# Altium schematic sheet DAU-3Phase-PSU.SchDoc
size A3
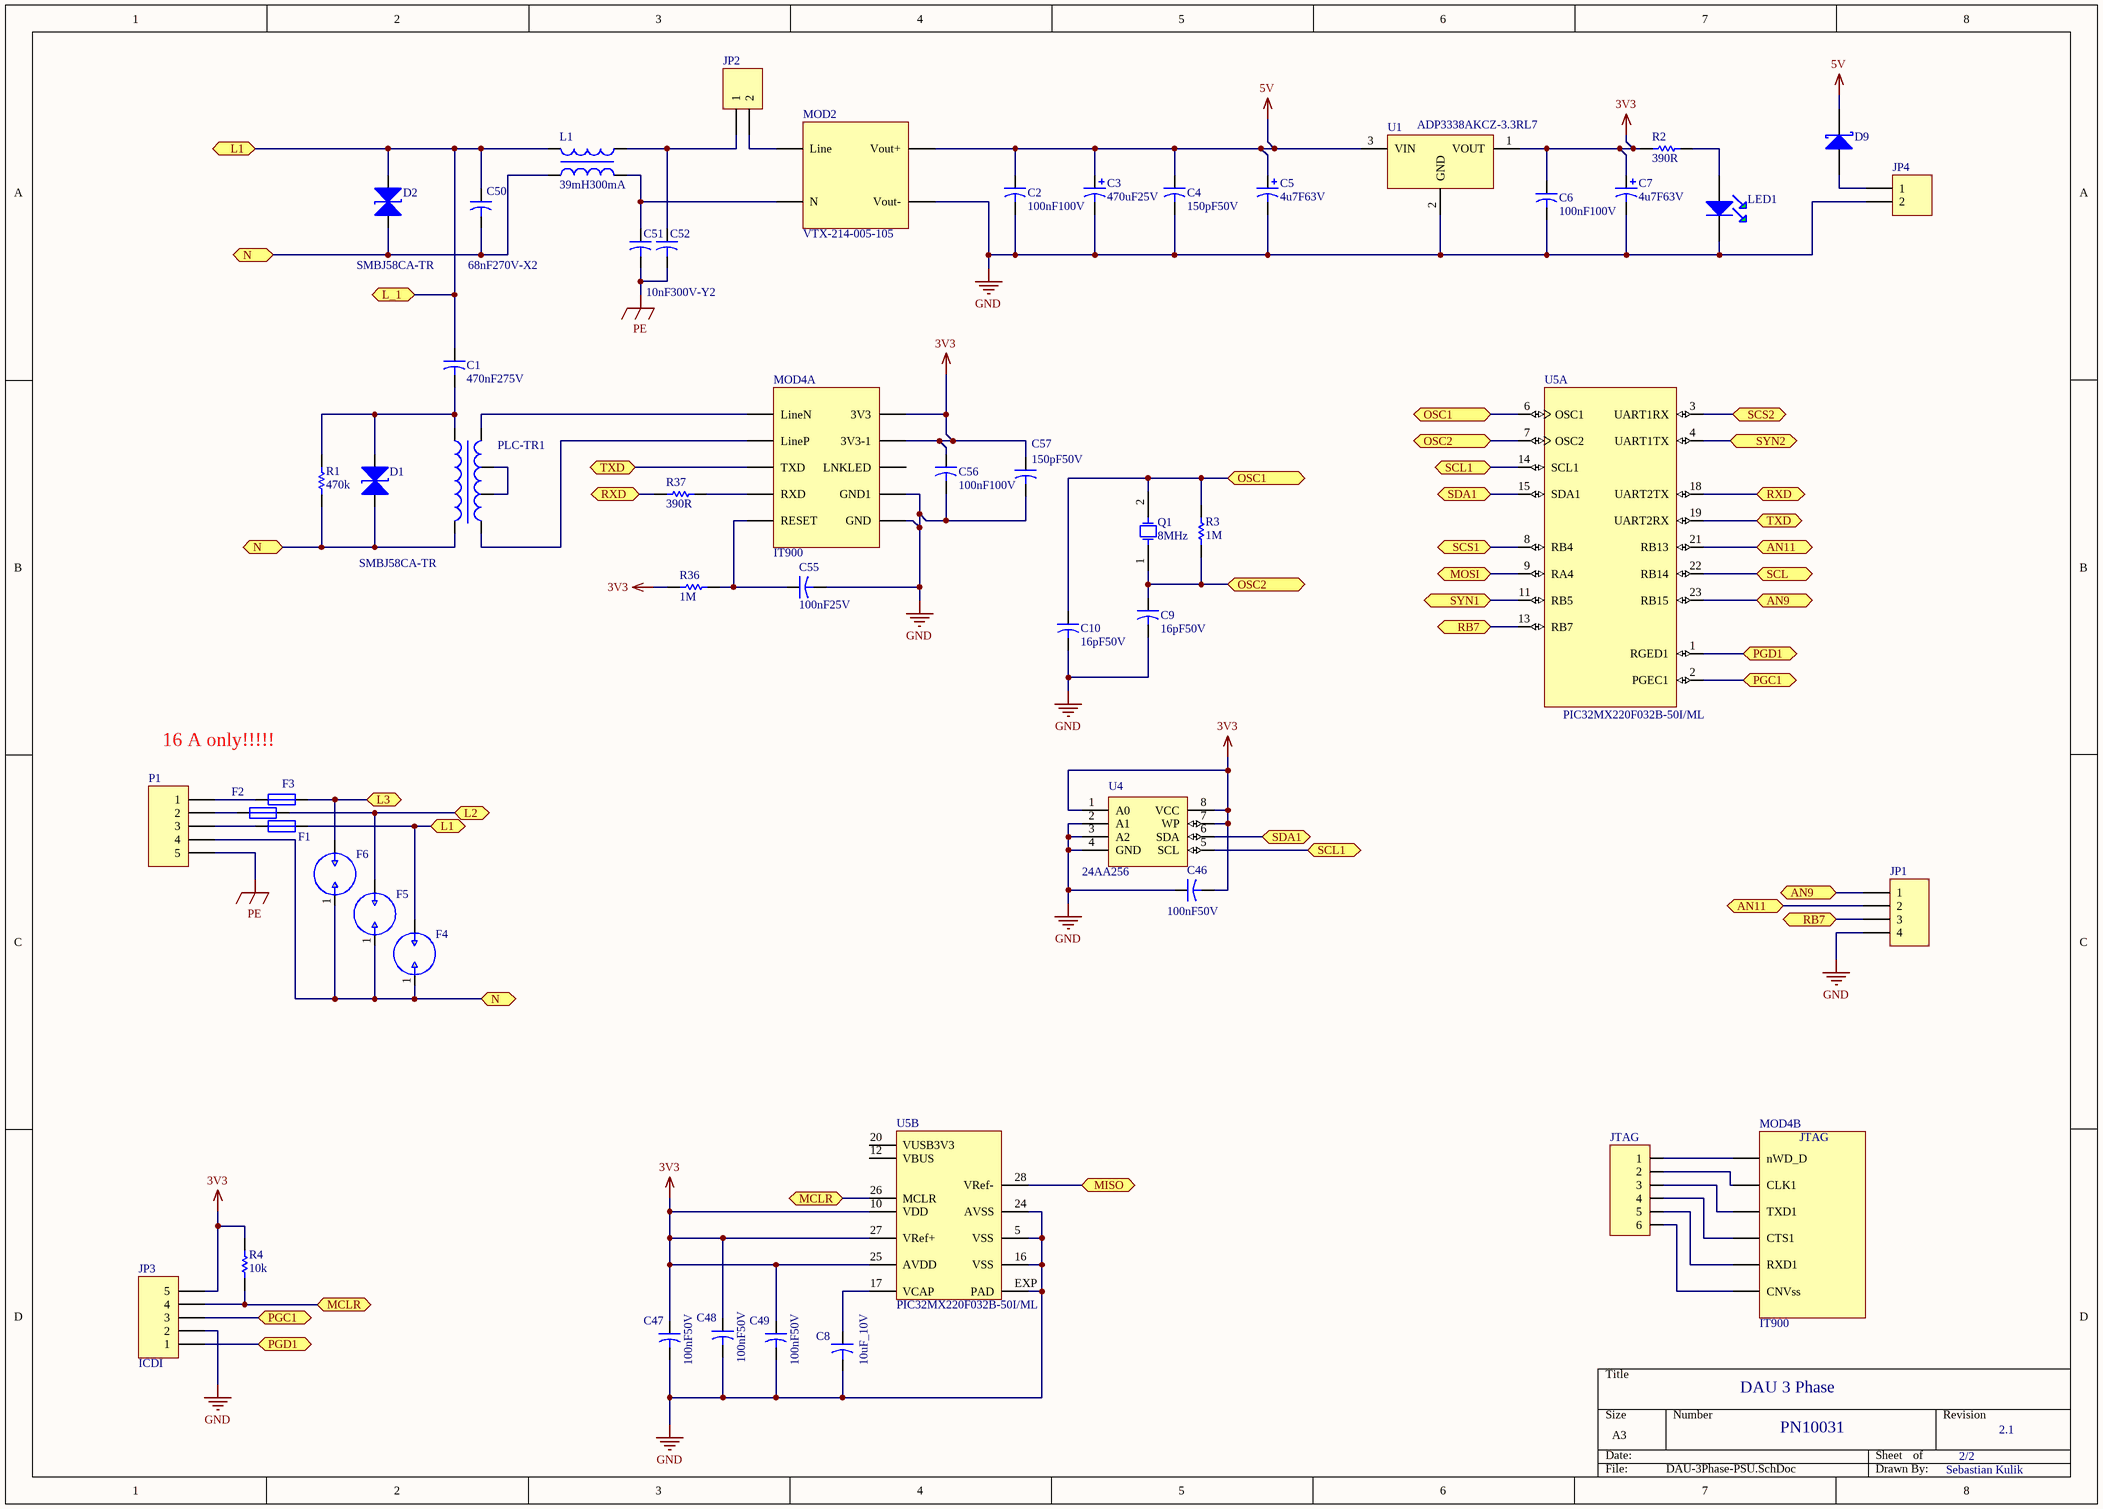
[diagram p0: DAU-3Phase-PSU.SchDoc]

## Parts
C1  470nF275V  [C150-072X183]
C2  value 100nF100V  [C0805]  (hidden comment: 100nF100V_0805)
C3  value 470uF25V  [Panasonic-FT-F_Case]  (hidden comment: 470uF25V_POL_FT)
C4  value 150pF50V  [C0402]  (hidden comment: 150p50V_0402)
C5  value 4u7F63V  [Panasonic-FT-C_Case]  (hidden comment: 4u7F25V_POL_TK)
C6  value 100nF100V  [C0805]  (hidden comment: 100nF100V_0805)
C7  value 4u7F63V  [Panasonic-FT-C_Case]  (hidden comment: 4u7F25V_POL_TK)
C8  value 10uF_10V  [C0603]  (hidden comment: 10uF10V_0603)
C9  value 16pF50V  [C0402]  (hidden comment: 16pF50V_0402)
C10  value 16pF50V  [C0402]  (hidden comment: 16pF50V_0402)
C46  value 100nF50V  [C0402]  (hidden comment: 100n50V_0402)
C47  value 100nF50V  [C0402]  (hidden comment: 100n50V_0402)
C48  value 100nF50V  [C0402]  (hidden comment: 100n50V_0402)
C49  value 100nF50V  [C0402]  (hidden comment: 100n50V_0402)
C50  68nF270V-X2  [Foil-7,5x10]
C51  10nF300V-Y2  [Foil-10x13]  (value not drawn)
C52  10nF300V-Y2  [Foil-10x13]
C55  value 100nF25V  [C0402]  (hidden comment: 100nF25V_0402)
C56  value 100nF100V  [C0805]  (hidden comment: 100nF100V_0805)
C57  value 150pF50V  [C0402]  (hidden comment: 150p50V_0402)
D1  SMBJ58CA-TR  [SMB]
D2  SMBJ58CA-TR  [SMB]
D9  RB160M-30TR  [SOD123]  (value not drawn)
F1  MCMET 250MA 250V  [TR5]  (value not drawn)
F2  MCMET 250MA 250V  [TR5]  (value not drawn)
F3  MCMET 250MA 250V  [TR5]  (value not drawn)
F4  GDT-SL1011A-1  [SL1011A/SL1011B]  (value not drawn)
F5  GDT-SL1011A-1  [SL1011A/SL1011B]  (value not drawn)
F6  GDT-SL1011A-1  [SL1011A/SL1011B]  (value not drawn)
JP1  Plug_4_90_2.54  [HDR1X4]  (value not drawn)
JP2  Header-2  [HDR1X2]  (value not drawn)
JP3  ICDI  [HDR1X5-1.27]
JP4  Header-2  [HDR1X2]  (value not drawn)
JTAG  JTAG  [HDR1X6-1.27]  (value not drawn)
L1  value 39mH300mA  [WE-CMB-XS]  (hidden comment: PowerChoke-2)
LED1  WL-SMCW-GREEN  [WE-0603]  (value not drawn)
MOD2  VTX-214-005-105  [VTX-214-005-105]
MOD4  IT900  [IT900-PIM]  (parts A,B of 2)
P1  Plug_05_5mm  [CONNECTOR_5_POL-5mm]  (value not drawn)
PLC-TR1  PLC-Transformer  [PLC-UEBERTRAGER_V2]  (value not drawn)
Q1  value 8MHz  [ABM3]  (hidden comment: Crystal_8MHz_1)
R1  value 470k  [0204/7]  (hidden comment: 470k_0204/7)
R2  value 390R  [R0402]  (hidden comment: 390R_0402)
R3  value 1M  [R0402]  (hidden comment: 1M_0402)
R4  value 10k  [R0402]  (hidden comment: 10k_0402)
R36  value 1M  [R0402]  (hidden comment: 1M_0402)
R37  value 390R  [R0402]  (hidden comment: 390R_0402)
U1  ADP3338AKCZ-3.3RL7  [SOT223-1]
U4  24AA256  [TSSOP8]
U5  PIC32MX220F032B-50I/ML  [QFN28_LONG_ERRLES-Vias]  (parts A,B of 2)

## Ports
AN9, AN11, L1, L2, L3, L_1, MCLR, MISO, MOSI, N, OSC1, OSC2, PGC1, PGD1, RB7, RXD, SCL, SCL1, SCS1, SCS2, SDA1, SYN1, SYN2, TXD

## Nets
3V3: C6.1 C7.1 C46.2 C47.1 C48.1 C49.1 C56.1 C57.1 JP3.5 MOD4.4(3V3) MOD4.5(3V3-1) R2.1 R4.2 R36.1 U1.1(VOUT) U4.1(A0) U4.7(WP) U4.8(VCC) U5.10(VDD) U5.25(AVDD) U5.27(VRef+)
5V: C2.1 C3.1 C4.1 C5.1 D9.1(K) MOD2.+VO(Vout+) U1.3(VIN)
GND: C2.2 C3.2 C4.2 C5.2 C6.2 C7.2 C8.2 C9.2 C10.2 C46.1 C47.2 C48.2 C49.2 C55.2 C56.2 C57.2 JP1.4 JP3.2 JP4.2 LED1.1(K) MOD2.-VO(Vout-) MOD4.2(GND) MOD4.3(GND1) U1.2(GND) U4.2(A1) U4.3(A2) U4.4(GND) U5.5(VSS) U5.16(VSS) U5.24(AVSS) U5.EXP(PAD)
PE: C51.2 C52.2 P1.5
AN9: JP1.1 U5.23(RB15) ; port AN9
AN11: JP1.2 U5.21(RB13) ; port AN11
L1: C1.1 C50.1 D2.2(A) F1.2 F4.2 L1.2 ; port L_1, port L1
L2: F2.2 F5.2 ; port L2
L3: F3.2 F6.2 ; port L3
MCLR: JP3.4 R4.1 U5.26(MCLR) ; port MCLR
MISO: U5.28(VRef-) ; port MISO
MOSI: U5.9(RA4) ; port MOSI
N: C50.2 D1.1(K) D2.1(K) F4.1 F5.1 F6.1 L1.1 P1.4 PLC-TR1.8N R1.1 ; port N
OSC1: C10.1 Q1.2 R3.2 U5.6(OSC1) ; port OSC1
OSC2: C9.1 Q1.1 R3.1 U5.7(OSC2) ; port OSC2
PGC1: JP3.3 U5.2(PGEC1) ; port PGC1
PGD1: JP3.1 U5.1(RGED1) ; port PGD1
RB7: JP1.3 U5.13(RB7) ; port RB7
RXD: R37.1 U5.18(UART2TX) ; port RXD
SCL: U5.22(RB14) ; port SCL
SCL1: U4.5(SCL) U5.14(SCL1) ; port SCL1
SCS1: U5.8(RB4) ; port SCS1
SCS2: U5.3(UART1RX) ; port SCS2
SDA1: U4.6(SDA) U5.15(SDA1) ; port SDA1
SYN1: U5.11(RB5) ; port SYN1
SYN2: U5.4(UART1TX) ; port SYN2
TXD: MOD4.16(TXD) U5.19(UART2RX) ; port TXD
NetC1_2: C1.2 D1.2(A) PLC-TR1.L5 R1.2
NetC8_1: C8.1 U5.17(VCAP)
NetC51_1: C51.1 L1.4 MOD2.N
NetC52_1: C52.1 JP2.1 L1.3
NetC55_1: C55.1 MOD4.9(RESET) R36.2
NetD9_2: D9.2(A) JP4.1
NetF1_1: F1.1 P1.3
NetF2_1: F2.1 P1.2
NetF3_1: F3.1 P1.1
NetJP2_2: JP2.2 MOD2.L(Line)
NetJTAG_1: JTAG.1 MOD4.26(nWD_D)
NetJTAG_2: JTAG.2 MOD4.27(CLK1)
NetJTAG_3: JTAG.3 MOD4.28(TXD1)
NetJTAG_4: JTAG.4 MOD4.29(CTS1)
NetJTAG_5: JTAG.5 MOD4.30(RXD1)
NetJTAG_6: JTAG.6 MOD4.31(CNVss)
NetLED1_2: LED1.2(A) R2.2
NetMOD4_17: MOD4.17(RXD) R37.2
NetMOD4_20: MOD4.20(LineN) PLC-TR1.1LINE1(LINE1)
NetMOD4_21: MOD4.21(LineP) PLC-TR1.4LINE2
NetPLC-TR1_2: PLC-TR1.2 PLC-TR1.3

Not connected (* = marked no-connect by the designer): MOD4 22(LNKLED); U5 12(VBUS) 20(VUSB3V3)

## Notes on the sheet
- 16 A only!!!!!
- DAU 3 Phase
- PN10031
- 2/2
- 2.1
- Sebastian Kulik
- (in symbol IT900, part B) JTAG

## Library data of the parts
C1 = 470nF275V: X2, PP; Deliverer PartNr: 2450023; Manufacturer: WE; Manufacturer PartNr: 890324025039CS; Deliverer: Farnell; TDE-PN: C0053; Published: 07.11.2014; Part Description: X2, PP; Publisher: Sebastian Kulik; PackageDescription: C150-072X183; Value: 470nF275V
C2 C6 C56 = 100nF100V_0805: AVX, X7R, 5%, 100V; Deliverer PartNr: 2332715; Manufacturer PartNr: 08051C104JAT2A; Deliverer: Farnell; TDE-PN: C0049; Published: 27.10.2014; Part Description: AVX, X7R, 5%, 100V; Publisher: Sebastian Kulik; PackageDescription: C0805; Manufacturer: AVX
C3 = 470uF25V_POL_FT: Panasonic, FT series; Deliverer PartNr: 1868411; Manufacturer PartNr: EEEFT1E471AP; Deliverer: Farnell; TDE-PN: C0048; Published: 23.09.2014; Part Description: Panasonic, FT series; Publisher: Sebastian Kulik; PackageDescription: Panasonic-FT-F; Manufacturer: Panasonic
C4 C57 = 150p50V_0402: C series, 5%, 50V; Part Description: GRM series,5%, 50V; Deliverer PartNr: 8819602; Manufacturer: Murata; Manufacturer PartNr: GRM1555C1H151JA01D; Deliverer: Farnell; TDE-PN: C0059; Published: 11.12.2014; Publisher: Sebastian Kulik; PackageDescription: C0402
C5 C7 = 4u7F25V_POL_TK: Panasonic, TK series; Deliverer PartNr: 9695990; Manufacturer PartNr: EEEFK1J4R7R; Deliverer: Farnell; TDE-PN: C0058; Published: 11.12.2014; Part Description: Panasonic, TK series; Publisher: Sebastian Kulik; PackageDescription: Panasonic-FT-C_Case; Manufacturer: Panasonic
C8 = 10uF10V_0603: AVX ,  X5R, 20%, 10V; Deliverer PartNr: 1867954RL; Manufacturer PartNr: 0603ZD106MAT2A; Deliverer: Farnell; TDE-PN: C0016; Published: 11.02.2014; Part Description: AVX ,  X5R, 20%, 10V; Publisher: Sebastian Kulik; PackageDescription: C0603; Manufacturer: AVX
C9 C10 = 16pF50V_0402: C series, 5%, 50V; Deliverer PartNr: 1865423; Manufacturer: Kemet; Manufacturer PartNr: C0402C160J5GACTU; Deliverer: Farnell; TDE-PN: C0020; Published: 11.03.2014; Part Description: C series, 5%, 50V; Publisher: Sebastian Kulik; PackageDescription: C0402
C46-C49 = 100n50V_0402: C series, X5R, 10%, 50V; Part Description: GRM series, X5R, 10%, 50V; Deliverer PartNr: 2218856; Manufacturer: Murata; Manufacturer PartNr: GRM155R61H104KE19D; Deliverer: Farnell; TDE-PN: C0044; Published: 13.02.2014; Publisher: Sebastian Kulik; PackageDescription: C0402
C50 = 68nF270V-X2: X2 capacitor; Deliverer PartNr: 890324022017CS; Deliverer: We; TDE-PN: C0061; Published: 21.01.2015; Part Description: X2 capacitor; Publisher: Sebastian Kulik; PackageDescription: Foil-7,5x10; Manufacturer: WE; Manufacturer PartNr: 890324022017CS; Value: 68nF270V-X2
C51 C52 = 10nF300V-Y2: Y2 capacitor; Deliverer PartNr: 2395807; Manufacturer: EPCOS; Manufacturer PartNr: B32021A3103M; Deliverer: Farnell; TDE-PN: C0062; Published: 22.01.2015; Part Description: Y2 capacitor; Publisher: Sebastian Kulik; PackageDescription: Foil-10x13; Value: 10nF300V-Y2
C55 = 100nF25V_0402: AVX, X5R, 10%, 25V; Deliverer PartNr: 1833862; Manufacturer PartNr: 04023D104KAT2A; Deliverer: Farnell; TDE-PN: C0036; Published: 09.12.2014; Part Description: AVX, X5R, 10%, 25V; Publisher: Sebastian Kulik; PackageDescription: C0402; Manufacturer: AVX
D1 D2 = SMBJ58CA-TR: Transient voltage suppressor, 600W; Deliverer PartNr: 9886346; Manufacturer: STMicro; TDE-PN: DIS0036; Deliverer: Farnell; Published: 22.01.2015; Publisher: Sebastian Kulik; PackageDescription: SMB; Manufacturer PartNr: SMBJ58CA-TR
D9 = RB160M-30TR: Diode Schottky,2A,40V; Deliverer PartNr: 1525480; Manufacturer: Rohm; TDE-PN: DIS0010; Deliverer: Farnell; Published: 17.02.2014; Publisher: Sebastian Kulik; PackageDescription: SOD123; Manufacturer PartNr: RB160M-30TR
F1-F3 = MCMET 250MA 250V: Deliverer PartNr: 1566065; Manufacturer: Multicomp; Deliverer: Farnell; TDFE-PN: M0008; Published: 05.11.2014; Publisher: Sebastian Kulik; PackageDescription: TR-5; Manufacturer PartNr: MCMET 250MA 250V; Value: MCMET 250MA 250V
F4-F6 = GDT-SL1011A-1: surge protector; Manufacturer PartNr: SL1011B250A; Deliverer PartNr: 1815462; Manufacturer: LITTLEFUSE; TDE-PN: P0031; Deliverer: Farnell; Published: 12.12.2014; Publisher: Sebastian Kulik; PackageDescription: SL1011A/SL1011B
JP1 = Plug_4_90_2.54: Plug, 4-Pin; Manufacturer PartNr: 613 004 111 21; Manufacturer: WE; TDE-PN: CON0033; LatestRevisionDate: 06.11.2014; LatestRevisionNote: Re-released for DXP Platform.; Publisher: Sebastian Kulik; Deliverer: WE; Deliverer PartNr: 613 004 111 21
JP2 JP4 = Header-2: Header, 2-Pin; LatestRevisionDate: 18.02.2014; LatestRevisionNote: Re-released for DXP Platform.; Publisher: Sebastian Kulik
JP3 = ICDI: Header, 5-Pin; LatestRevisionDate: 17-Jul-2002; LatestRevisionNote: Re-released for DXP Platform.; Publisher: Sebastian Kulik; PackageDescription: HDR1X1.27
JTAG = ICDI_1: Header, 6-Pin; LatestRevisionDate: 17-Jul-2002; LatestRevisionNote: Re-released for DXP Platform.; Publisher: Sebastian Kulik; PackageDescription: HDR1X1.27
L1 = PowerChoke-1_2: Power choke/EMC filter; Deliverer PartNr: 744821039; Deliverer: WE; TDE-PN: P0033; Manufacturer: WE; Manufacturer PartNr: 744821039; Published: 21.01.2015; Publisher: Sebastian Kulik; PackageDescription: WE-CMB-XS
LED1 = WL-SMCW-GREEN: LED, 0603, green; Manufacturer PartNr: 150060GS75000; TDE-PN: DIS0024; Deliverer: WE; Published: 24.05.2014; Publisher: Sebastian Kulik; PackageDescription: WE-0603; Deliverer PartNr: 150060GS75000; Manufacturer: WE
MOD2 = VTX-214-005-105: PSU module; Deliverer PartNr: 2401040; Manufacturer: VIGORTRONIX; Deliverer: Farnell; TDE-PN: MOD00005; Published: 15.12.2014; PackageDescription: VTX-214-005-105; Publisher: Sebastian Kulik; Manufacturer PartNr: VTX-214-005-105
MOD4 = IT900: RMS converter; Deliverer PartNr: MOD00001; Deliverer: TDE; TDE-PN: MOD00004; Published: 15.12.2014; PackageDescription: TO100-10; Publisher: Sebastian Kulik; Manufacturer PartNr: MOD00001; Manufacturer: TDE
P1 = Plug_05_5mm: Plug, 08-Pin; Manufacturer PartNr: 1715187; Manufacturer: Phoenix Contact; Deliverer PartNr: 2509901353; Deliverer: RS Components; TDE-PN: CON0037; LatestRevisionDate: 19.11.2014; LatestRevisionNote: Re-released for DXP Platform.; Publisher: Sebastian Kulik
PLC-TR1 = PLC-Transformer: Deliverer PartNr: T60403-K5024-X044; Manufacturer: VAC; Deliverer: SOS Electronic; TDE-PN: P0025; Manufacturer PartNr: T60403-K5024-X044; Published: 13.05.2014; Publisher: Sebastian Kulik; PackageDescription: PLC-UEBERTRAGER_V2
Q1 = Crystal_8MHz_1: Crystal, ABM3-8.000MHZ-D2Y-T; Deliverer PartNr: 2101329; Manufacturer: Abacon; Deliverer: Farnell; TDE-PN: P0032; Published: 20.01.2015; PackageDescription: ABM3; Publisher: Sebastian Kulik; Manufacturer PartNr: ABM3-8.000MHZ-D2Y-T
R1 = 470k_0204/7: MRS25 series, 1%, 600mW; Manufacturer: Vishay; Manufacturer PartNr: MRS25000C4703FCT00; Deliverer PartNr: 9468455; TDE-PN: R0061; Deliverer: Farnell; Published: 07.11.2014; Publisher: Sebastian Kulik; PackageDescription: 0204/7; Part Description: MRS25 series, 1%, 600mW
R2 R37 = 390R_0402: CRCW series, 125mW, 1%; Manufacturer: Vishay; Manufacturer PartNr: CRCW0402390RFKEAHP; Deliverer PartNr: 1469662RL; TDE-PN: R0044; Deliverer: Farnell; Published: 30.04.2014; Publisher: Sebastian Kulik; PackageDescription: 0402; Part Description: CRCW series, 125mW, 1%
R3 R36 = 1M_0402: Vishay CRCW series, 64mW, 1%; Manufacturer PartNr: CRCW04021M00FKED; Deliverer PartNr: 1469667; Part Description: Vishay CRCW series, 63mW, 1%; TDE-PN: R0005; Deliverer: Farnell; Published: 03.04.2014; Publisher: Sebastian Kulik; PackageDescription: 0402; Manufacturer: Vishay
R4 = 10k_0402: Vishay CRCW series, 125mW, 1%; Manufacturer PartNr: CRCW040210K0FKEAHP; Deliverer PartNr: 1738864; TDE-PN: R0012; Deliverer: Farnell; Published: 12.02.2014; Publisher: Sebastian Kulik; PackageDescription: 0402; Manufacturer: Vishay; Part Description: Vishay CRCW series, 125mW, 1%
U1 = ADP3338AKCZ-3.3RL7: LDO, 3V3_1A; Deliverer PartNr: 1651283; Manufacturer: ADI; Deliverer: Farnell; TDE-PN: IC0003; Published: 26.03.2014; PackageDescription: SOT223-1; Publisher: Sebastian Kulik; Manufacturer PartNr: ADP3338AKCZ-3.3RL7
U4 = 24AA256: I2C  EEPROM; Deliverer PartNr: 1331295; Manufacturer: Microchip; Deliverer: Farnell; TDE-PN: IC0005; Published: 28.03.2014; PackageDescription: TSSOP8; Publisher: Sebastian Kulik; Manufacturer PartNr: 24AA256
U5 = PIC32MX220F032B-50I/ML: High Performance ROM-less Microcontroller; Deliverer PartNr: 2357345; Manufacturer: Microchip; Deliverer: Farnell; TDE-PN: IC0063; Published: 19.01.2015; PackageDescription: QFN28; Publisher: Sebastian Kulik; Manufacturer PartNr: PIC32MX220F032B-50I/ML